# EasyEDA Pro project 一体板.epro, schematic Schematic4

## Sheets
1 主控部分: Create Date: 2023-07-24; Page Name: 主控部分; Project Name: 独轮车七月v2; Schematic Name: Schematic4; Update Date: 2023-07-28; Company: 嘉立创EDA; Page Size: A4; Version: V1.0
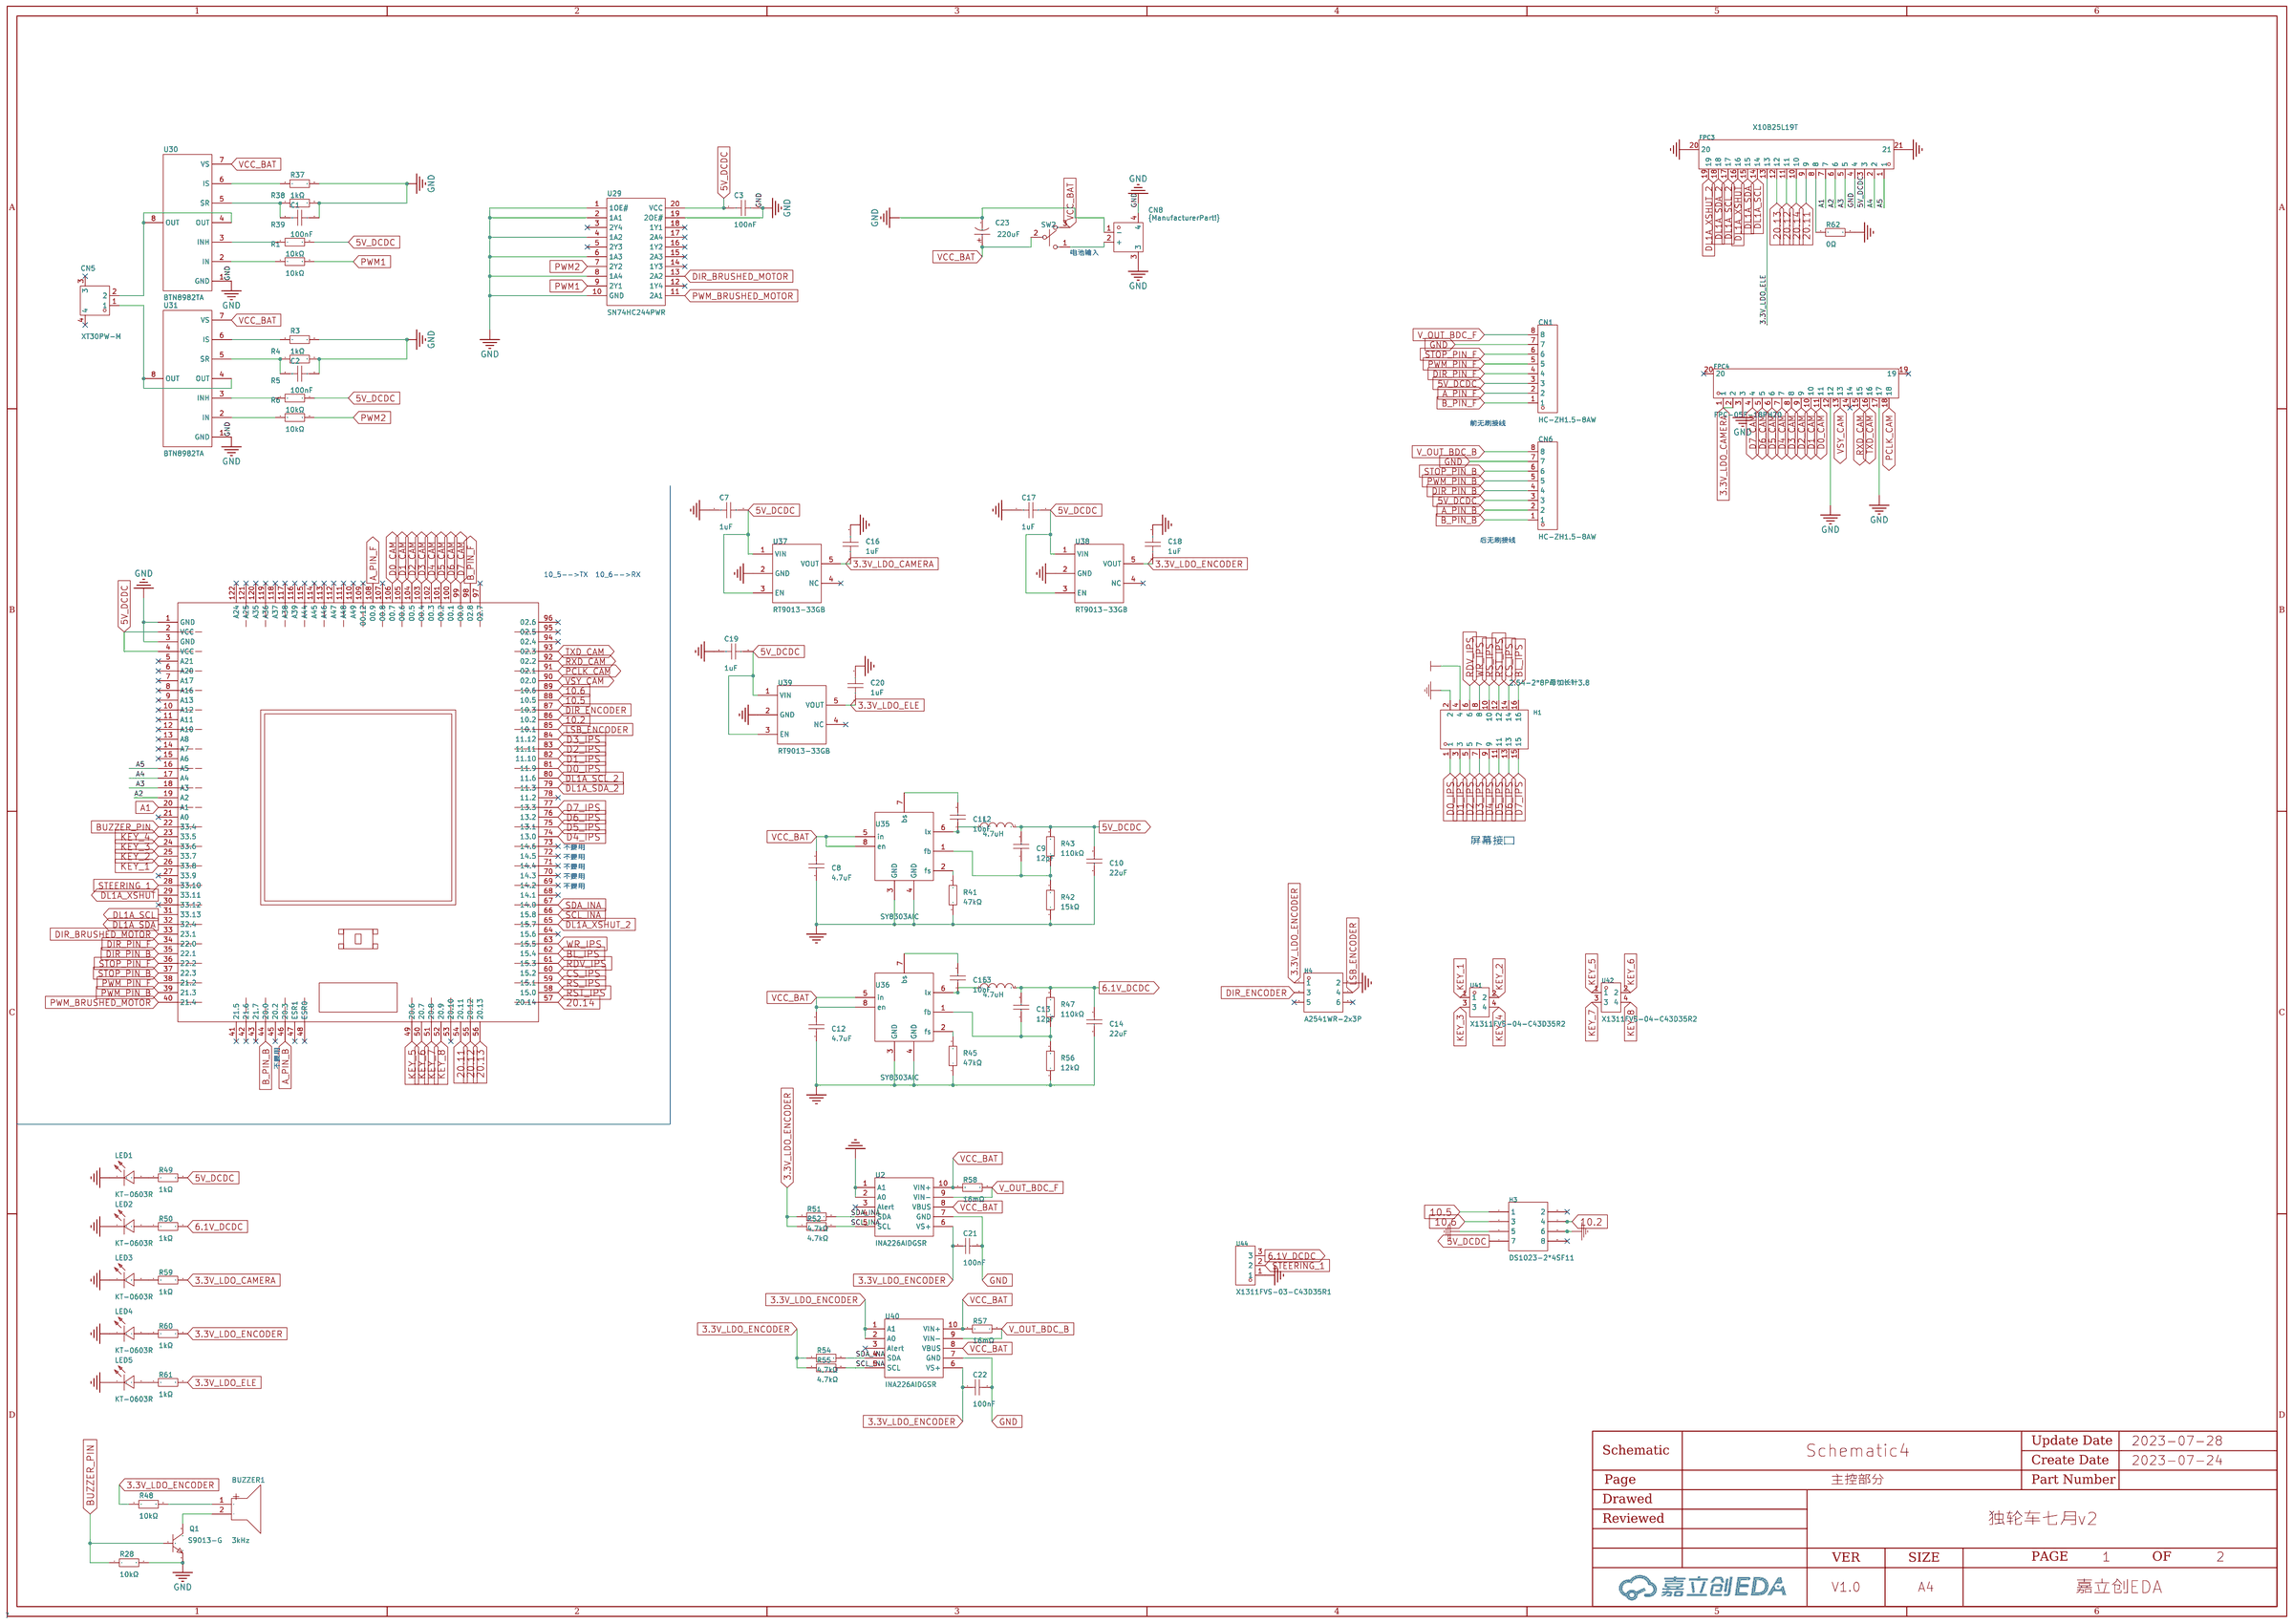
[diagram p4: 主控部分]
2 P2
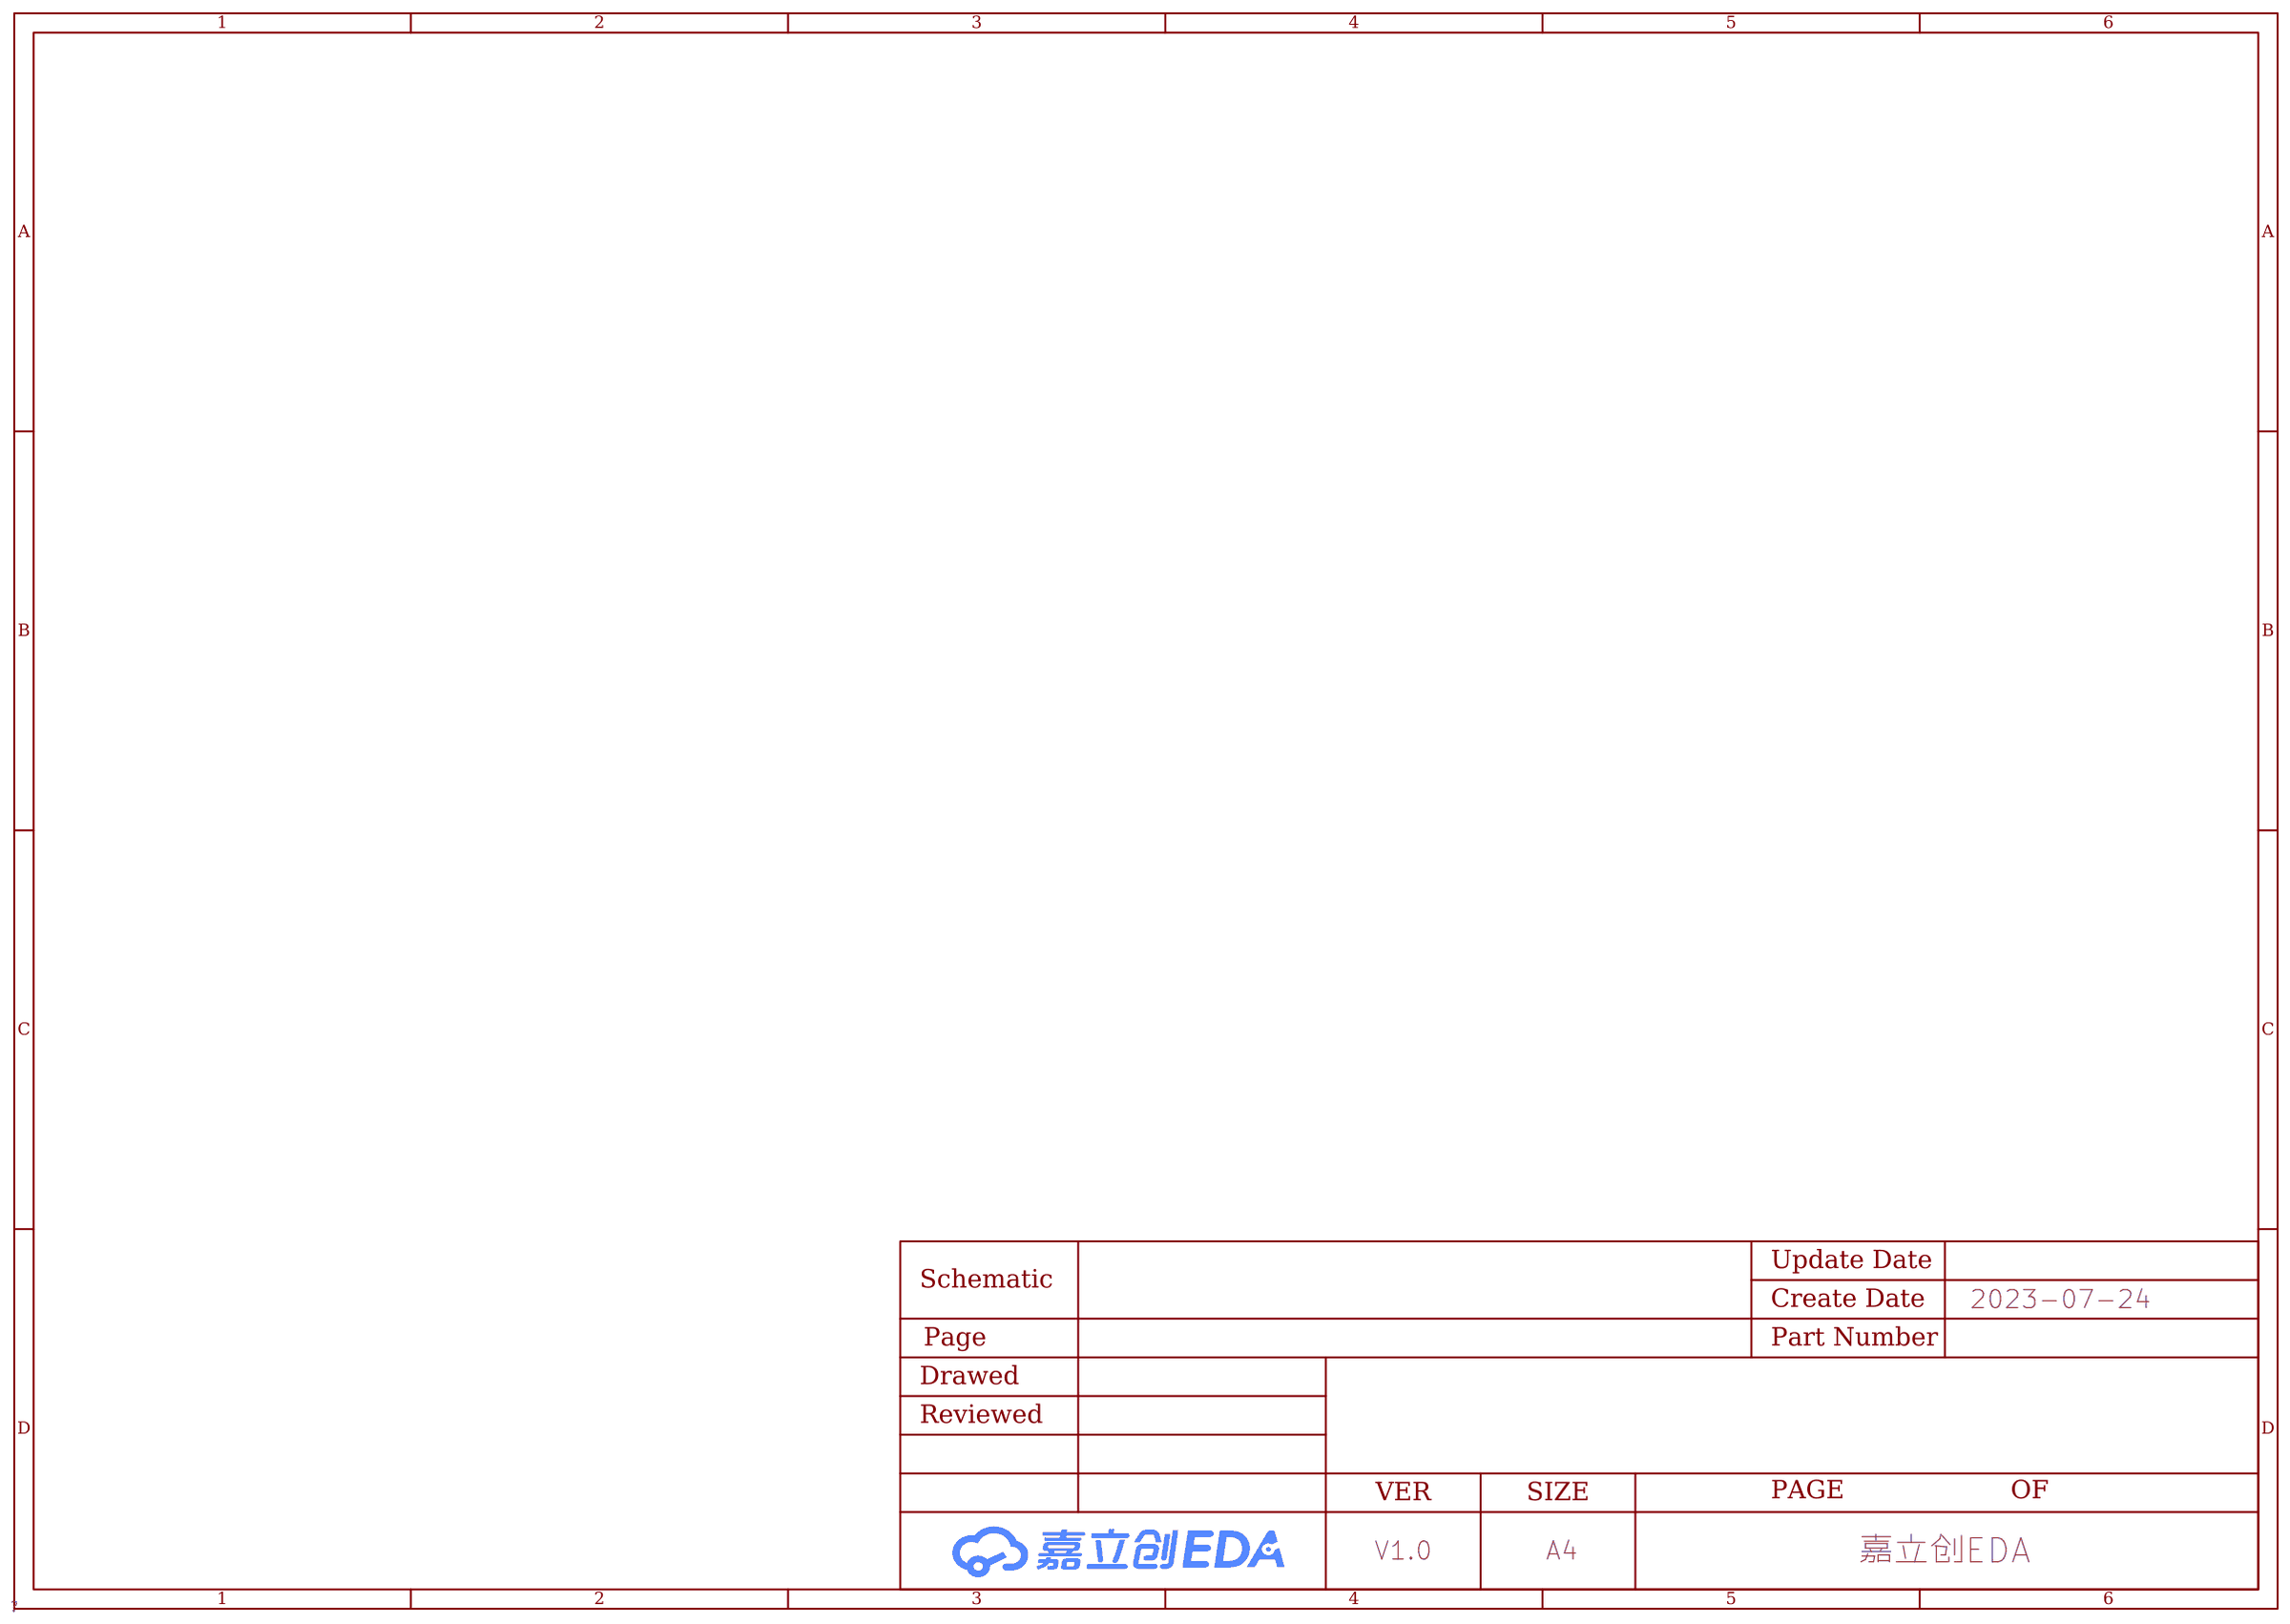
[diagram p5: P2]

## Parts
BUZZER1  3kHz  [BUZ-TH_BD9.0-P5.00-D0.6-FD]
C1  100nF  [C0603]
C2  100nF  [C0603]
C3  100nF  [C0603]
C7  1uF  [C0603]
C8  4.7uF  [C1206]
C9  12pF  [C0603]
C10  22uF  [C1206]
C11  10nF  [C0603]
C12  4.7uF  [C1206]
C13  12pF  [C0603]
C14  22uF  [C1206]
C15  10nF  [C0603]
C16  1uF  [C0603]
C17  1uF  [C0603]
C18  1uF  [C0603]
C19  1uF  [C0603]
C20  1uF  [C0603]
C21  100nF  [C0603]
C22  100nF  [C0603]
C23  220uF  [CAP-TH_BD10.0-P5.00-D1.0-FD]
CN1  HC-ZH1.5-8AW  [CONN-TH_8P-P1.50_HCTL_HC-ZH1.5-8AW]
CN5  XT30PW-M  [CONN-TH_XT30PW-M]
CN6  HC-ZH1.5-8AW  [CONN-TH_8P-P1.50_HCTL_HC-ZH1.5-8AW]
CN8  -  [CONN-TH_XT60PW-M]
FPC3  X10B25L19T  [FPC-SMD_X10B25U19T]
FPC4  FPC-05F-18PH20  [FPC-SMD_18P-P0.50_FPC-05F-18PH20]
H1  2.54-2*8P母加长针3.8  [HDR-TH_16P-P2.54-V-F-R2-C8-S2.54-1]
H3  DS1023-2*4SF11  [HDR-TH_8P-P2.54-V-F-R2-C4-S2.54-1]
H4  A2541WR-2x3P  [HDR-TH_6P-P2.54-H-R2-C3-S2.54-W10.0_A2541WR]
L2  4.7uH  [IND-SMD_L5.4-W5.2_FXL0530]
L3  4.7uH  [IND-SMD_L5.4-W5.2_FXL0530]
LED1  KT-0603R  [LED0603-RD]
LED2  KT-0603R  [LED0603-RD]
LED3  KT-0603R  [LED0603-RD]
LED4  KT-0603R  [LED0603-RD]
LED5  KT-0603R  [LED0603-RD]
Q1  S9013-G  [SOT-23-3_L2.9-W1.3-P1.90-LS2.4-BR]
R1  10kΩ  [R0603]
R3  1kΩ  [R0603]
R4  0603WAF5100T5E  [R0603]
R5  10kΩ  [R0603]
R6  10kΩ  [R0603]
R28  10kΩ  [R0603]
R37  1kΩ  [R0603]
R38  0603WAF5100T5E  [R0603]
R39  10kΩ  [R0603]
R41  47kΩ  [R0603]
R42  15kΩ  [R0603]
R43  110kΩ  [R0603]
R45  47kΩ  [R0603]
R47  110kΩ  [R0603]
R48  10kΩ  [R0603]
R49  1kΩ  [R0603]
R50  1kΩ  [R0603]
R51  4.7kΩ  [R0603]
R52  4.7kΩ  [R0603]
R54  4.7kΩ  [R0603]
R55  4.7kΩ  [R0603]
R56  12kΩ  [R0603]
R57  16mΩ  [R1206]
R58  16mΩ  [R1206]
R59  1kΩ  [R0603]
R60  1kΩ  [R0603]
R61  1kΩ  [R0603]
R62  0Ω  [R0603]
SW2  MT-0-103-A101-M200-RS+PJ  [SW-TH_MT-0-103-A101-M200-RS]
U1  TC387核心板 COPY  [TC264逐飞]
U2  INA226AIDGSR  [MSOP-10_L3.0-W3.0-P0.50-LS5.0-BL]
U29  SN74HC244PWR  [TSSOP-20_L6.5-W4.4-P0.65-LS6.4-BL]
U30  BTN8982TA  [TO-263-7_L10.2-W10.4-P1.27-LS14.4-TL]
U31  BTN8982TA  [TO-263-7_L10.2-W10.4-P1.27-LS14.4-TL]
U35  SY8303AIC  [TSOT-23-8_L2.9-W1.6-P0.65-LS2.8-BR]
U36  SY8303AIC  [TSOT-23-8_L2.9-W1.6-P0.65-LS2.8-BR]
U37  RT9013-33GB  [SOT-23-5_L3.0-W1.7-P0.95-LS2.8-BL]
U38  RT9013-33GB  [SOT-23-5_L3.0-W1.7-P0.95-LS2.8-BL]
U39  RT9013-33GB  [SOT-23-5_L3.0-W1.7-P0.95-LS2.8-BL]
U40  INA226AIDGSR  [MSOP-10_L3.0-W3.0-P0.50-LS5.0-BL]
U41  X1311FVS-04-C43D35R2  [HDR-SMD_4P-P1.27-V-F-LS4.5_R2]
U42  X1311FVS-04-C43D35R2  [HDR-SMD_4P-P1.27-V-F-LS4.5_R2]
U44  X1311FVS-03-C43D35R1  [HDR-SMD_3P-P1.27-V-F_R1]

## Library data of the parts
BUZZER1 = HNB09A03: 驱动方式:电磁式;构造类型:有源;额定电压:3V;工作电压:1.5V~4.5V;消耗电流:30mA;频率:3kHz;声压(SPL):85dB@10cm;直径(φD):9mm;长度:-;宽度:-;高度:5.5mm;工作温度:-20~+70;; LCSC Part Name: 电磁式有源一体蜂鸣器HNB09A03; Supplier Part: C96102; Manufacturer: 华能; Supplier Footprint: 插件,P=5mm; JLCPCB Part Class: ExtendedPart; Datasheet: https://atta.szlcsc.com/upload/public/pdf/source/20170522/1495448326172.pdf; Supplier: LCSC; Oscillator Circuit: 电磁式; Technology Type: 有源; Rated Voltage: 3V; Operating Voltage: 1.5V~4.5V; Current Consumption: 30mA; Sound Pressure Level (SPL): 85dB@10cm; Diameter (φD): 9mm; Height: 5.5mm; Operating Temperature: -20~+70
C1-C3 = CC0603KRX7R9BB104: 容值:100nF;精度:±10%;额定电压:50V;材质(温度系数):X7R;; LCSC Part Name: 100nF±10%50V; Supplier Part: C14663; Manufacturer: YAGEO(国巨); Supplier Footprint: 0603; JLCPCB Part Class: BasicPart; Datasheet: https://atta.szlcsc.com/upload/public/pdf/source/20170116/1484561234239.pdf; Supplier: LCSC; Tolerance: ±10%; Voltage Rated: 50V; Temperature Coefficient: X7R
C7 C16-C20 = 0603B105K500NT: 温度系数:X7R;精度:±10%;额定电压:50V;容值:1uF;; LCSC Part Name: 1uF(105) ±10% 50V; Supplier Part: C90540; Manufacturer: FH(风华); Supplier Footprint: 0603; JLCPCB Part Class: Extended Part; Datasheet: https://atta.szlcsc.com/upload/public/pdf/source/20170923/C90540_1506149560830988967.pdf; Supplier: LCSC; Temperature Coefficient: X7R; Tolerance: ±10%; Voltage Rated: 50V
C8 C12 = 1206B475K500NT: 容值:4.7uF;精度:±10%;额定电压:50V;材质(温度系数):X7R;; LCSC Part Name: 4.7uF±10%50V; Supplier Part: C29823; Manufacturer: FH(风华); Supplier Footprint: 1206; JLCPCB Part Class: BasicPart; Datasheet: https://atta.szlcsc.com/upload/public/pdf/source/20170923/C29823_1506149432461988716.pdf; Supplier: LCSC; Tolerance: ±10%; Voltage Rated: 50V; Temperature Coefficient: X7R
C9 C13 = CL10C120JB8NNNC: 容值:12pF;精度:±5%;额定电压:50V;材质(温度系数):C0G;; LCSC Part Name: 12pF±5%50V; Supplier Part: C38523; Manufacturer: SAMSUNG(三星); Supplier Footprint: 0603; JLCPCB Part Class: BasicPart; Datasheet: https://atta.szlcsc.com/upload/public/pdf/source/20160103/1457707725436.pdf; Supplier: LCSC; Tolerance: ±5%; Voltage Rated: 50V; Temperature Coefficient: C0G
C10 C14 = CL31A226KAHNNNE: 容值:22uF;精度:±10%;额定电压:25V;材质(温度系数):X5R;; LCSC Part Name: 22uF±10%25V; Supplier Part: C12891; Manufacturer: SAMSUNG(三星); Supplier Footprint: 1206; JLCPCB Part Class: BasicPart; Datasheet: https://atta.szlcsc.com/upload/public/pdf/source/20160103/1457707667836.pdf; Supplier: LCSC; Tolerance: ±10%; Voltage Rated: 25V; Temperature Coefficient: X5R
C11 C15 = 0603B103K500NT: 容值:10nF;精度:±10%;额定电压:50V;材质(温度系数):X7R;; LCSC Part Name: 10nF±10%50V; Supplier Part: C57112; Manufacturer: FH(风华); Supplier Footprint: 0603; JLCPCB Part Class: BasicPart; Datasheet: https://atta.szlcsc.com/upload/public/pdf/source/20170923/C57112_1506149495135988846.pdf; Supplier: LCSC; Tolerance: ±10%; Voltage Rated: 50V; Temperature Coefficient: X7R
C21 C22 = 0603B104K500NT: 容值:100nF;精度:±10%;额定电压:50V;材质(温度系数):X7R;; LCSC Part Name: 100nF±10%50V; Supplier Part: C30926; Manufacturer: FH(风华); Supplier Footprint: 0603; JLCPCB Part Class: 扩展库; Datasheet: https://atta.szlcsc.com/upload/public/pdf/source/20170923/C30926_1506149436298988724.pdf; Supplier: LCSC; Tolerance: ±10%; Voltage Rated: 50V; Temperature Coefficient: X7R
C23 = KM227M050G13RR0VH2FP0: 容值:220uF;脚间距:5mm;纹波电流:-;额定电压:50V;等效串联电阻:-;精度:±20%;工作寿命:2000hrs 105;电容体直径:10mm;工作温度:-;电容体长度:13mm;; LCSC Part Name: 220uF50V; Supplier Part: C45105; Manufacturer: CX(承兴); Supplier Footprint: 径向引线,10x13mm; JLCPCB Part Class: ExtendedPart; Datasheet: https://atta.szlcsc.com/upload/public/pdf/source/20151029/1457707529682.pdf; Supplier: LCSC; Lead Spacing: 5mm; Rated Voltage: 50V; Tolerance: ±20%; Lifetime @ Temp: 2000hrs 105; φD: 10mm; L: 13mm
CN1 CN6 = HC-ZH1.5-8AW: 参考系列:ZH;间距:1.5mm;插针结构:1x8P;排数:1;每排PIN数:8;行距:-;公母:公型插针;安装方式:弯插;额定电流:1A;工作温度范围:-25~+85;; LCSC Part Name: 8P间距P=1.5mm; Supplier Part: C2845571; Manufacturer: HCTL(华灿天禄); Supplier Footprint: 插件,P=1.5mm; JLCPCB Part Class: ExtendedPart; Datasheet: https://atta.szlcsc.com/upload/public/pdf/source/20211122/624702E7E83328BF37B6C704FA01E49F.pdf; Supplier: LCSC; Reference Series: ZH; Pitch: 1.5mm; Pins Structure: 1x8P; Number of Rows: 1; Number of PINs Per Row: 8; Gender: 公型插针; Mounting Style: 弯插; Current Rating (Max): 1A; Operating Temperature Range: -25~+85
CN5 = XT30PW-M: Socket,DCsupply,XT30,male,PIN:2; LCSC Part Name: XT30PW-M公头; Supplier Part: C431092; Manufacturer: AMASS(艾迈斯); Supplier Footprint: ThroughHole; JLCPCB Part Class: ExtendedPart; Datasheet: https://atta.szlcsc.com/upload/public/pdf/source/20220222/6A9F22F7850E25B33E1BE430ADF8560B.pdf; Supplier: LCSC
CN8 = XT60PW-M: 模型锂电连接器; LCSC Part Name: XT60PW公头板插卧式; Supplier Part: C98732; Manufacturer: AMASS(艾迈斯); Supplier Footprint: ThroughHole; JLCPCB Part Class: ExtendedPart; Datasheet: https://atta.szlcsc.com/upload/public/pdf/source/20180125/C98732_15168617837851301983.pdf; Supplier: LCSC
FPC3 = X10B25L19T: 间距:1mm;触点数量:19;锁定特性:抽屉式;安装类型:卧贴;触点类型:下接;工作温度范围:-40℃~+85℃;焊接温度(最大值):260℃;; LCSC Part Name: 1mm P数:19 抽屉式 下接 镀锡; Supplier Part: C500178; Manufacturer: XKB Connectivity(中国星坤); Supplier Footprint: SMD,P=1mm; JLCPCB Part Class: Extended Part; Supplier: LCSC; Pitch: 1mm; Number of Contacts: 19; Locking Feature: 抽屉式; Mounting Type: 卧贴; Contact Type: 下接; Height Above Board: 2.5mm; FFC, FCB Thickness: 0.3mm; Contact Material: 磷青铜; Contact Plating: 锡; Operating Temperature Range: -40℃~+85℃; Welding Temperature (Max): 260℃
FPC4 = FPC-05F-18PH20: 间距:0.5mm;触点数量:18P;锁定特性:翻盖式;安装类型:卧贴;触点类型:下接;工作温度范围:-25℃~+85℃;; LCSC Part Name: 0.5mm P数:18P 翻盖式 下接; Supplier Part: C2856802; Manufacturer: XUNPU(讯普); Supplier Footprint: SMD,P=0.5mm; JLCPCB Part Class: 扩展库; Datasheet: https://atta.szlcsc.com/upload/public/pdf/source/20210922/C2856802_2A845D1961F33AEC1ED22CECB292335F.pdf; Supplier: LCSC; Pitch: 0.5mm; Number of Contacts: 18P; Locking Feature: 翻盖式; Mounting Type: 卧贴; Contact Type: 下接; Height Above Board: 2mm; FFC, FCB Thickness: 0.3mm; Operating Temperature Range: -25℃~+85℃
H1 = 2.54-2*8P母加长针3.8: 排数:双排;总孔位数:16P;间距:2.54mm;行距:-;安装类型:直插;塑高:-;触头材质:-;触头镀层:-;; LCSC Part Name: 2.54mm 加高加长; Supplier Part: C72555; Manufacturer: BOOMELE(博穆精密); Supplier Footprint: 插件,P=2.54mm; JLCPCB Part Class: 扩展库; Supplier: LCSC; Number of Rows: 双排; Number of Holes: 16P; Pitch: 2.54mm; Mounting Type: 直插
H3 = DS1023-2*4SF11: 排数:双排;总孔位数:8;间距:2.54mm;插孔结构:2x4P;行距:2.54mm;安装类型:直插;塑高:-;触头材质:-;触头镀层:-;; LCSC Part Name: 2.54mm 2x4P; Supplier Part: C92271; Manufacturer: CONNFLY; Supplier Footprint: 插件,P=2.54mm; JLCPCB Part Class: Extended Part; Supplier: LCSC; Number of Rows: 双排; Number of Holes: 8; Pitch: 2.54mm; Holes Structure: 2x4P; Row Spacing: 2.54mm; Mounting Type: 直插
H4 = A2541WR-2x3P: 排数:双排;总PIN位数:6P;间距:2.54mm;插针结构:2x3P;行距:2.54mm;安装类型:弯插;圆针/方针:方针;额定电流:-;额定电压:-;配合针长度:6mm;塑高:2.54mm;触头材质:黄铜;触头镀层:-;工作温度范围:-40℃~+105℃;颜色:黑色;; LCSC Part Name: 2.54mm 2x3P 弯插 方针; Supplier Part: C239334; Manufacturer: CJT(长江连接器); Supplier Footprint: 弯插,P=2.54mm; JLCPCB Part Class: 扩展库; Datasheet: https://atta.szlcsc.com/upload/public/pdf/source/20180724/C239359_48B1BC0CA1B4E4396A63955AAFD15564.pdf; Supplier: LCSC; Number of Rows: 双排; Number of Pins: 6P; Pitch: 2.54mm; Pin Structure: 2x3P; Row Spacing: 2.54mm; Mounting Type: 弯插; Circluar Pins/Square Pins: 方针; Length of Mating Pin: 6mm; Insulation Height: 2.54mm; Contact Material: 黄铜; Operating Temperature Range: -40℃~+105℃; Color: 黑色; link: https://item.szlcsc.com/238438.html?ref=editoramp;logined=true
L2 L3 = FXL0530-4R7-M: 电感值:4.7uH;精度:±20%;额定电流:4.5A;饱和电流(Isat):5A;; LCSC Part Name: 4.7uH±20%4.5A50mΩ; Supplier Part: C177246; Manufacturer: cjiang(长江微电); Supplier Footprint: SMD,5.2x5.4mm; JLCPCB Part Class: ExtendedPart; Datasheet: https://atta.szlcsc.com/upload/public/pdf/source/20190322/C177246_D81D0671B72FD9DE4B58607F480A6AE0.pdf; Supplier: LCSC; Tolerance: ±20%; Rated Current: 4.5A; Saturation Current (Isat): 5A; DC Resistance (DCR): 50mΩ
LED1-LED5 = KT-0603R: 发光颜色:红灯;二极管配置:-;透镜颜色:-;主波长:-;色温:-;功率:-;发光角度:-;安装方式:-;工作温度:-40℃~+85℃;; LCSC Part Name: 0603红灯高亮; Supplier Part: C2286; Manufacturer: KENTO; Supplier Footprint: 0603; JLCPCB Part Class: BasicPart; Datasheet: https://atta.szlcsc.com/upload/public/pdf/source/20160616/1466072038404.pdf; Supplier: LCSC; Emitted Color: 红灯; Operating Temperature: -40℃~+85℃
Q1 = S9013-G: 晶体管类型:NPN;集射极击穿电压(Vceo):25V;集电极电流(Ic):500mA;功率(Pd):300mW;; LCSC Part Name: S9013H档(200-350)H档(200-350); Supplier Part: C164888; Manufacturer: CJ(江苏长电/长晶); Supplier Footprint: SOT-23(SOT-23-3); JLCPCB Part Class: ExtendedPart; Datasheet: https://atta.szlcsc.com/upload/public/pdf/source/20171228/C164888_15144412896081213891.pdf; Supplier: LCSC; Transistor Type: NPN; Collector-Emitter Breakdown Voltage (Vceo): 25V; Collector Current (Ic): 500mA; Power Dissipation (Pd): 300mW
R1 R5 R6 R39 = 0603WAF1002T5E: 电阻类型:厚膜电阻;阻值:10kΩ;精度:±1%;功率:100mW;温度系数:±100ppm/℃;最大工作电压:75V;工作温度范围:-55℃~+155℃;; LCSC Part Name: 10kΩ±1%100mW; Supplier Part: C25804; Manufacturer: UNI-ROYAL(厚声); Supplier Footprint: 0603; JLCPCB Part Class: BasicPart; Datasheet: https://atta.szlcsc.com/upload/public/pdf/source/20200306/C422600_1E6D84923E4A46A82E41ADD87F860B5C.pdf; Supplier: LCSC; Type: 厚膜电阻; Tolerance: ±1%; Power(Watts): 100mW; Temperature Coefficient: ±100ppm/℃; Overload Voltage (Max): 75V; Operating Temperature Range: -55℃~+155℃
R3 R37 = 0603WAF1001T5E: 电阻类型:厚膜电阻;阻值:1kΩ;精度:±1%;功率:100mW;温度系数:±100ppm/℃;最大工作电压:75V;工作温度范围:-55℃~+155℃;; LCSC Part Name: 1kΩ±1%100mW; Supplier Part: C21190; Manufacturer: UNI-ROYAL(厚声); Supplier Footprint: 0603; JLCPCB Part Class: BasicPart; Datasheet: https://atta.szlcsc.com/upload/public/pdf/source/20200306/C422600_1E6D84923E4A46A82E41ADD87F860B5C.pdf; Supplier: LCSC; Type: 厚膜电阻; Tolerance: ±1%; Power(Watts): 100mW; Temperature Coefficient: ±100ppm/℃; Overload Voltage (Max): 75V; Operating Temperature Range: -55℃~+155℃
R4 R38 = 0603WAF5100T5E: LCSC Part Name: 510Ω(5100)±1%编带; Supplier Part: C23193; Manufacturer: UNI-ROYAL(厚声); Supplier Footprint: 0603; JLCPCB Part Class: BasicPart; Datasheet: https://atta.szlcsc.com/upload/public/pdf/source/20170920/C23193_1505901125164982575.pdf; Supplier: LCSC
R28 R48 = 0603WAF1002T5E: 电阻类型:厚膜电阻;阻值:10kΩ;精度:±1%;功率:100mW;温度系数:±100ppm/;最大工作电压:75V;工作温度范围:-55~+155;; LCSC Part Name: 10kΩ±1%100mW; Supplier Part: C25804; Manufacturer: UNI-ROYAL(厚声); Supplier Footprint: 0603; JLCPCB Part Class: BasicPart; Datasheet: https://atta.szlcsc.com/upload/public/pdf/source/20200306/C422600_1E6D84923E4A46A82E41ADD87F860B5C.pdf; Supplier: LCSC; Type: 厚膜电阻; Tolerance: ±1%; Power(Watts): 100mW; Temperature Coefficient: ±100ppm/; Overload Voltage (Max): 75V; Operating Temperature Range: -55~+155
R41 R45 = 0603WAF4702T5E: 电阻类型:厚膜电阻;阻值:47kΩ;精度:±1%;功率:100mW;; LCSC Part Name: 47kΩ±1%100mW; Supplier Part: C25819; Manufacturer: UNI-ROYAL(厚声); Supplier Footprint: 0603; JLCPCB Part Class: BasicPart; Datasheet: https://atta.szlcsc.com/upload/public/pdf/source/20200306/C422600_1E6D84923E4A46A82E41ADD87F860B5C.pdf; Supplier: LCSC; Type: 厚膜电阻; Tolerance: ±1%; Power(Watts): 100mW; Temperature Coefficient: ±100ppm/℃; Overload Voltage (Max): 75V; Operating Temperature Range: -55℃~+155℃
R42 = 0603WAF1502T5E: 电阻类型:厚膜电阻;阻值:15kΩ;精度:±1%;功率:100mW;; LCSC Part Name: 15kΩ±1%100mW; Supplier Part: C22809; Manufacturer: UNI-ROYAL(厚声); Supplier Footprint: 0603; JLCPCB Part Class: BasicPart; Datasheet: https://atta.szlcsc.com/upload/public/pdf/source/20200306/C422600_1E6D84923E4A46A82E41ADD87F860B5C.pdf; Supplier: LCSC; Type: 厚膜电阻; Tolerance: ±1%; Power(Watts): 100mW; Temperature Coefficient: ±100ppm/℃; Overload Voltage (Max): 75V; Operating Temperature Range: -55℃~+155℃
R43 R47 = 0603WAF1103T5E: 电阻类型:厚膜电阻;阻值:110kΩ;精度:±1%;功率:100mW;; LCSC Part Name: 110kΩ±1%100mW; Supplier Part: C25805; Manufacturer: UNI-ROYAL(厚声); Supplier Footprint: 0603; JLCPCB Part Class: BasicPart; Datasheet: https://atta.szlcsc.com/upload/public/pdf/source/20200306/C422600_1E6D84923E4A46A82E41ADD87F860B5C.pdf; Supplier: LCSC; Type: 厚膜电阻; Tolerance: ±1%; Power(Watts): 100mW; Temperature Coefficient: ±100ppm/℃; Overload Voltage (Max): 75V; Operating Temperature Range: -55℃~+155℃
R49 R50 R59-R61 = 0603WAF1001T5E: 电阻类型:厚膜电阻;阻值:1kΩ;精度:±1%;功率:100mW;; LCSC Part Name: 1kΩ±1%100mW; Supplier Part: C21190; Manufacturer: UNI-ROYAL(厚声); Supplier Footprint: 0603; JLCPCB Part Class: BasicPart; Datasheet: https://atta.szlcsc.com/upload/public/pdf/source/20200306/C422600_1E6D84923E4A46A82E41ADD87F860B5C.pdf; Supplier: LCSC; Type: 厚膜电阻; Tolerance: ±1%; Power(Watts): 100mW; Temperature Coefficient: ±100ppm/℃; Overload Voltage (Max): 75V; Operating Temperature Range: -55℃~+155℃
R51 R52 R54 R55 = 0603WAJ0472T5E: 电阻类型:厚膜电阻;阻值:4.7kΩ;精度:±5%;功率:100mW;; LCSC Part Name: 4.7kΩ ±5% 100mW; Supplier Part: C25999; Manufacturer: UNI-ROYAL(厚声); Supplier Footprint: 0603; JLCPCB Part Class: 扩展库; Datasheet: https://atta.szlcsc.com/upload/public/pdf/source/20200306/C422600_1E6D84923E4A46A82E41ADD87F860B5C.pdf; Supplier: LCSC; Type: 厚膜电阻; Tolerance: ±5%; Power(Watts): 100mW; Temperature Coefficient: ±100ppm/℃; Overload Voltage (Max): 75V; Operating Temperature Range: -55℃~+155℃
R56 = 0603WAF1202T5E: 电阻类型:厚膜电阻;阻值:12kΩ;精度:±1%;功率:100mW;; LCSC Part Name: 12kΩ±1%100mW; Supplier Part: C22790; Manufacturer: UNI-ROYAL(厚声); Supplier Footprint: 0603; JLCPCB Part Class: BasicPart; Datasheet: https://atta.szlcsc.com/upload/public/pdf/source/20200306/C422600_1E6D84923E4A46A82E41ADD87F860B5C.pdf; Supplier: LCSC; Type: 厚膜电阻; Tolerance: ±1%; Power(Watts): 100mW; Temperature Coefficient: ±100ppm/℃; Overload Voltage (Max): 75V; Operating Temperature Range: -55℃~+155℃
R57 R58 = STE1206M1W0R016F: 阻值:16mΩ;精度:±1%;功率:1W;; LCSC Part Name: 16mΩ ±1% 1W; Supplier Part: C201282; Manufacturer: WALTER(华德); Supplier Footprint: 1206; JLCPCB Part Class: Extended Part; Datasheet: https://atta.szlcsc.com/upload/public/pdf/source/20181227/C201282_8179CF41C3955E65F608C73E4B97CCAC.pdf; Supplier: LCSC; Tolerance: ±1%; Power(Watts): 1W; Temperature Coefficient: ±50ppm/℃
R62 = 0603WAF0000T5E: 温度系数:-;精度:±1%;阻值:0Ω;功率:1/10W;最大工作电压:75V;工作温度范围:-55℃~+155℃;; LCSC Part Name: 0Ω±1%; Supplier Part: C21189; Manufacturer: UNI-ROYAL(厚声); Supplier Footprint: 0603; JLCPCB Part Class: BasicPart; Datasheet: https://atta.szlcsc.com/upload/public/pdf/source/20170920/C21189_1505887441435980537.pdf; Supplier: LCSC; Tolerance: ±1%; Power(Watts): 1/10W; Overload Voltage (Max): 75V; Operating Temperature Range: -55℃~+155℃
SW2 = MT-0-103-A101-M200-RS+PJ: 额定电流:5A;额定电压(AC):125V;电路结构:单刀双掷;钮柄形状:圆柱钮柄;引脚样式:焊片;安装方式:直插;工作温度:-25~+85;开关长度:13mm;开关宽度:8mm;开关高度:28.6mm;; LCSC Part Name: 小型钮子三脚三档(五件套); Supplier Part: C1788493; Manufacturer: YUENFUNG(源丰); Supplier Footprint: 插件; JLCPCB Part Class: ExtendedPart; Datasheet: https://atta.szlcsc.com/upload/public/pdf/source/20201225/C1788493_608759AD4D4A20FF90A03E3E3321FD91.pdf; Supplier: LCSC; Contact Current: 5A; Voltage Rating (AC): 125V; Circuit: 单刀双掷; Actuator Type: 圆柱钮柄; Pin Style: 焊片; Mounting Style: 直插; Operating Temperature: -25~+85; Switch Length: 13mm; Switch Width: 8mm; Switch Height: 28.6mm
U1 = TC264核心板 COPY: Supplier: 逐飞
U2 U40 = INA226AIDGSR: INA226 支持报警功能的 36V、双向、超高精度、低侧/高侧、I2C 输出电流/功率监控器; Supplier Part: C49851; Manufacturer: TI(德州仪器); Supplier Footprint: MSOP-10; JLCPCB Part Class: 扩展库; Datasheet: https://atta.szlcsc.com/upload/public/pdf/source/20150601/1457707317382.pdf; Supplier: LCSC
U29 = SN74HC244PWR: 类型:缓冲器，非反相;电源电压:2V~6V;输入类型:-;输出类型:三态;低电平输出电流(IOL):7.8mA;高电平输出电流(IOH):7.8mA;工作温度:-40℃~+85℃;; Supplier Part: C6835; Manufacturer: TI(德州仪器); Supplier Footprint: TSSOP-20; JLCPCB Part Class: ExtendedPart; Datasheet: https://atta.szlcsc.com/upload/public/pdf/source/20140704/1457707115574.pdf; Supplier: LCSC; Type: 缓冲器，非反相; Supply Voltage: 2V~6V; output type: 三态; Current-OutputLow: 7.8mA; Current-OutputHigh: 7.8mA; Operating temperature: -40℃~+85℃
U30 U31 = BTN8982TA: 高电流PN半桥驱动IC; Supplier Part: C74175; Manufacturer: Infineon(英飞凌); Supplier Footprint: TO-263-7; JLCPCB Part Class: ExtendedPart; Datasheet: https://atta.szlcsc.com/upload/public/pdf/source/20170221/1487670306389.pdf; Supplier: LCSC
U35 U36 = SY8303AIC: 功能类型:降压型;同步整流:-;输出通道数:-;拓扑结构:-;输入电压:-;输出电流(最大值):-;开关频率:-;; LCSC Part Name: 降压型; Supplier Part: C97054; Manufacturer: silergy(矽力杰); Supplier Footprint: TSOT-23-8; JLCPCB Part Class: ExtendedPart; Datasheet: https://atta.szlcsc.com/upload/public/pdf/source/20170308/1488958431714.pdf; Supplier: LCSC; Function: 降压型
U37-U39 = RT9013-33GB: 输出类型:固定;输出极性:正;最大输入电压:5.5V;输出电压:3.3V;输出电流:500mA;电源纹波抑制比(PSRR):50dB@(10kHz);; Supplier Part: C47773; Manufacturer: RICHTEK(立锜); Supplier Footprint: SOT-23-5; JLCPCB Part Class: Extended Part; Datasheet: https://atta.szlcsc.com/upload/public/pdf/source/20150504/1457707282459.pdf; Supplier: LCSC; Output Type: 固定; Output Polarity: 正; Number of Outputs: 1; Maximum Input Voltage: 5.5V; Output Voltage: 3.3V; Dropout Voltage: 400mV@(500mA); Output Current: 500mA; Power Supply Rejection Ratio (PSRR): 50dB@(10kHz)
U41 U42 = X1311FVS-04-C43D35R2: 排数:单排;总孔位数:4P;间距:1.27mm;插孔结构:1x4P;行距:-;安装类型:立贴;圆孔/方孔:方孔;额定电流:1A;额定电压:250V;插孔方向:顶部;塑高:4.3mm;触头材质:黄铜;触头镀层:金;工作温度范围:-40℃~+105℃;焊接温度(最大值):260℃;; LCSC Part Name: 1.27mm 1x4P; Supplier Part: C2881513; Manufacturer: XKB Connectivity(中国星坤); Supplier Footprint: SMD,P=1.27mm(交错脚); JLCPCB Part Class: Extended Part; Datasheet: https://atta.szlcsc.com/upload/public/pdf/source/20211011/0A98DB21FA5DE73171AE3D6ADB4E7C8C.pdf; Supplier: LCSC; Number of Rows: 单排; Number of Holes: 4P; Pitch: 1.27mm; Holes Structure: 1x4P; Mounting Type: 立贴; Circular Hole / Square Hole: 方孔; Current Rating (Max): 1A; Voltage Rating (Max): 250V; Holes Direction: 顶部; Insulation Height: 4.3mm; Contact Material: 黄铜; Contact Plating: 金; Operating Temperature Range: -40℃~+105℃; Welding Temperature (Max): 260℃
U44 = X1311FVS-03-C43D35R1: 排数:单排;总孔位数:3P;间距:1.27mm;插孔结构:1x3P;行距:-;安装类型:立贴;圆孔/方孔:方孔;额定电流:1A;额定电压:250V;插孔方向:顶部;塑高:4.3mm;触头材质:黄铜;触头镀层:金;工作温度范围:-40℃~+105℃;焊接温度(最大值):260℃;; LCSC Part Name: 1.27mm 1x3P; Supplier Part: C2881493; Manufacturer: XKB Connectivity(中国星坤); Supplier Footprint: SMD,P=1.27mm(交错脚); JLCPCB Part Class: Extended Part; Datasheet: https://atta.szlcsc.com/upload/public/pdf/source/20211011/0A98DB21FA5DE73171AE3D6ADB4E7C8C.pdf; Supplier: LCSC; Number of Rows: 单排; Number of Holes: 3P; Pitch: 1.27mm; Holes Structure: 1x3P; Mounting Type: 立贴; Circular Hole / Square Hole: 方孔; Current Rating (Max): 1A; Voltage Rating (Max): 250V; Holes Direction: 顶部; Insulation Height: 4.3mm; Contact Material: 黄铜; Contact Plating: 金; Operating Temperature Range: -40℃~+105℃; Welding Temperature (Max): 260℃

## Nets
3.3V_LDO_CAMERA: C16.1 FPC4.1 FPC4.2 R59.2 U37.5(VOUT)
3.3V_LDO_ELE: C20.1 FPC3.13 R61.2 U39.5(VOUT)
3.3V_LDO_ENCODER: C18.1 C21.1 C22.1 H1.4 H4.1 R48.1 R51.1 R52.1 R54.1 R55.1 R60.2 U2.6(VS+) U38.5(VOUT) U40.1(A1) U40.2(A0) U40.6(VS+)
5V_DCDC: C3.2 C7.2 C9.2 C10.2 C17.2 C19.2 CN1.3 CN6.3 FPC3.3 H3.7 L2.2 R5.2 R39.2 R43.2 R49.2 U1.2(VCC) U1.4(VCC) U29.20(VCC) U37.1(VIN) U37.3(EN) U38.1(VIN) U38.3(EN) U39.1(VIN) U39.3(EN)
6.1V_DCDC: C13.2 C14.2 L3.2 R47.2 R50.2 U44.3
GND: C1.1 C2.1 C3.1 C7.1 C8.1 C10.1 C12.1 C14.1 C16.2 C17.1 C18.2 C19.1 C20.2 C21.2 C22.2 C23.2 CN1.7 CN6.7 CN8.1(-) CN8.3 CN8.4 FPC3.4 FPC3.20 FPC3.21 FPC4.3 FPC4.12 FPC4.17 H1.2 H3.5 H3.6 H4.2 LED1.1(K) LED2.1(K) LED3.1(K) LED4.1(K) LED5.1(K) Q1.2(E) R3.2 R4.2 R28.2 R37.2 R38.2 R41.1 R42.1 R45.1 R56.1 R62.2 U1.1(GND) U1.3(GND) U2.1(A1) U2.2(A0) U2.7(GND) U29.1(1OE#) U29.2(1A1) U29.4(1A2) U29.6(1A3) U29.8(1A4) U29.10(GND) U29.19(2OE#) U30.1(GND) U31.1(GND) U35.3(GND) U35.4(GND) U36.3(GND) U36.4(GND) U37.2(GND) U38.2(GND) U39.2(GND) U40.7(GND) U44.1
VCC_BAT: C8.2 C12.2 C23.1 R57.1 R58.1 SW2.2 SW2.3 U2.8(VBUS) U2.10(VIN+) U30.7(VS) U31.7(VS) U35.5(in) U35.8(en) U36.5(in) U36.8(en) U40.8(VBUS) U40.10(VIN+)
10.2: H3.4 U1.86(10.2)
10.5: H3.1 U1.88(10.5)
10.6: H3.3 U1.89(10.6)
20.11: FPC3.9 U1.54(20.11)
20.12: FPC3.11 U1.55(20.12)
20.13: FPC3.12 U1.56(20.13)
20.14: FPC3.10 U1.57(20.14)
A1: FPC3.7 U1.20(A1)
A2: FPC3.6 U1.19(A2)
A3: FPC3.5 U1.18(A3)
A4: FPC3.2 U1.17(A4)
A5: FPC3.1 U1.16(A5)
A_PIN_B: CN6.2 U1.46(20.3)
A_PIN_F: CN1.2 U1.108(00.9)
B_PIN_B: CN6.1 U1.44(20.0)
B_PIN_F: CN1.1 U1.98(02.8)
BL_IPS: H1.16 U1.62(15.4)
BUZZER_PIN: Q1.1(B) R28.1 U1.22(33.4)
CS_IPS: H1.14 U1.60(15.2)
D0_CAM: FPC4.11 U1.106(00.7)
D0_IPS: H1.1 U1.81(11.9)
D1_CAM: FPC4.10 U1.105(00.6)
D1_IPS: H1.3 U1.82(11.10)
D2_CAM: FPC4.9 U1.104(00.5)
D2_IPS: H1.5 U1.83(11.11)
D3_CAM: FPC4.8 U1.103(00.4)
D3_IPS: H1.7 U1.84(11.12)
D4_CAM: FPC4.7 U1.102(00.3)
D4_IPS: H1.9 U1.74(13.0)
D5_CAM: FPC4.6 U1.101(00.2)
D5_IPS: H1.11 U1.75(13.1)
D6_CAM: FPC4.5 U1.100(00.1)
D6_IPS: H1.13 U1.76(13.2)
D7_CAM: FPC4.4 U1.99(00.0)
D7_IPS: H1.15 U1.77(13.3)
DIR_BRUSHED_MOTOR: U1.33(23.1) U29.13(2A2)
DIR_ENCODER: H4.3 U1.87(10.3)
DIR_PIN_B: CN6.4 U1.35(22.1)
DIR_PIN_F: CN1.4 U1.34(22.0)
DL1A_SCL: FPC3.14 U1.31(33.13)
DL1A_SCL_2: FPC3.17 U1.80(11.6)
DL1A_SDA: FPC3.15 U1.32(32.4)
DL1A_SDA_2: FPC3.18 U1.79(11.3)
DL1A_XSHUT: FPC3.16 U1.29(33.11)
DL1A_XSHUT_2: FPC3.19 U1.65(15.7)
KEY_1: U1.26(33.8) U41.1
KEY_2: U1.25(33.7) U41.2
KEY_3: U1.24(33.6) U41.3
KEY_4: U1.23(33.5) U41.4
KEY_5: U1.49(20.6) U42.1
KEY_6: U1.50(20.7) U42.2
KEY_7: U1.51(20.8) U42.3
KEY_8: U1.52(20.9) U42.4
LSB_ENCODER: H4.4 U1.85(10.1)
PCLK_CAM: FPC4.18 U1.91(02.1)
PWM1: R1.2 U29.9(2Y1)
PWM2: R6.2 U29.7(2Y2)
PWM_BRUSHED_MOTOR: U1.40(21.4) U29.11(2A1)
PWM_PIN_B: CN6.5 U1.39(21.3)
PWM_PIN_F: CN1.5 U1.38(21.2)
RDV_IPS: H1.6 U1.61(15.3)
RS_IPS: H1.10 U1.59(15.1)
RST_IPS: H1.12 U1.58(15.0)
RXD_CAM: FPC4.15 U1.92(02.2)
SCL_INA: R52.2 R55.2 U1.66(15.8) U2.5(SCL) U40.5(SCL)
SDA_INA: R51.2 R54.2 U1.67(14.0) U2.4(SDA) U40.4(SDA)
STEERING_1: U1.28(33.10) U44.2
STOP_PIN_B: CN6.6 U1.37(22.3)
STOP_PIN_F: CN1.6 U1.36(22.2)
TXD_CAM: FPC4.16 U1.93(02.3)
V_OUT_BDC_B: CN6.8 R57.2 U40.9(VIN-)
V_OUT_BDC_F: CN1.8 R58.2 U2.9(VIN-)
VSY_CAM: FPC4.13 U1.90(02.0)
WR_IPS: H1.8 U1.63(15.5)
$1N3822: R41.2 U35.2(fs)
$1N3823: C9.1 R42.2 R43.1 U35.1(fb)
$1N3825: C11.2 U35.7(bs)
$1N3827: C11.1 L2.1 U35.6(lx)
$1N4452: R45.2 U36.2(fs)
$1N4454: C13.1 R47.1 R56.2 U36.1(fb)
$1N4462: C15.2 U36.7(bs)
$1N4472: C15.1 L3.1 U36.6(lx)
$1N5768: BUZZER1.1(+) R48.2
$1N5769: BUZZER1.2(-) Q1.3(C)
$1N14459: R37.1 U30.6(IS)
$1N14461: C1.2 R38.1 U30.5(SR)
$1N14462: R39.1 U30.3(INH)
$1N14464: R1.1 U30.2(IN)
$1N14466: R3.1 U31.6(IS)
$1N14468: C2.2 R4.1 U31.5(SR)
$1N14469: R5.1 U31.3(INH)
$1N14471: R6.1 U31.2(IN)
$1N14482: CN5.1 U31.4(OUT) U31.8(OUT)
$1N14483: CN5.2 U30.4(OUT) U30.8(OUT)
$1N14659: CN8.2(+) SW2.1
$1N15502: LED1.2(A) R49.1
$1N15505: LED2.2(A) R50.1
$1N15508: LED3.2(A) R59.1
$1N15805: LED4.2(A) R60.1
$1N15808: LED5.2(A) R61.1
$1N22497: FPC3.8 R62.1

Not connected (* = marked no-connect by the designer): CN5 3* 4*; FPC4 14* 19* 20*; H3 2* 8*; H4 5* 6*; U1 5(A21)* 6(A20)* 7(A17)* 8(A16)* 9(A13)* 10(A12)* 11(A11)* 12(A10)* 13(A8)* 14(A7)* 15(A6)* 21(A0)* 27(33.9)* 30(33.12)* 41(21.5)* 42(21.6)* 43(21.7)* 45(20.2)* 47(ESR1)* 48(ESR0)* 53(20.10)* 64(15.6)* 68(14.1)* 69(14.2)* 70(14.3)* 71(14.4)* 72(14.5)* 73(14.6)* 78(11.2)* 94(02.4)* 95(02.5)* 96(02.6)* 97(02.7)* 107(00.8)* 109(00.12)* 110(A49)* 111(A48)* 112(A47)* 113(A46)* 114(A45)* 115(A44)* 116(A39)* 117(A38)* 118(A37)* 119(A36)* 120(A35)* 121(A25)* 122(A24)*; U2 3(Alert)*; U29 3(2Y4)* 5(2Y3)* 12(1Y4)* 14(1Y3)* 15(2A3)* 16(1Y2)* 17(2A4)* 18(1Y1)*; U37 4(NC)*; U38 4(NC)*; U39 4(NC)*; U40 3(Alert)*

## Notes on the sheets
sheet 1
- 电池输入
- 前无刷接线
- 后无刷接线
- 10_5-->TX  10_6-->RX
- 屏幕接口
- 不要用
- 不要用
- 不要用
- 不要用
- 不要用
- 不要用
